# EAGLE schematic Totbox (EAGLE 9.6.2)
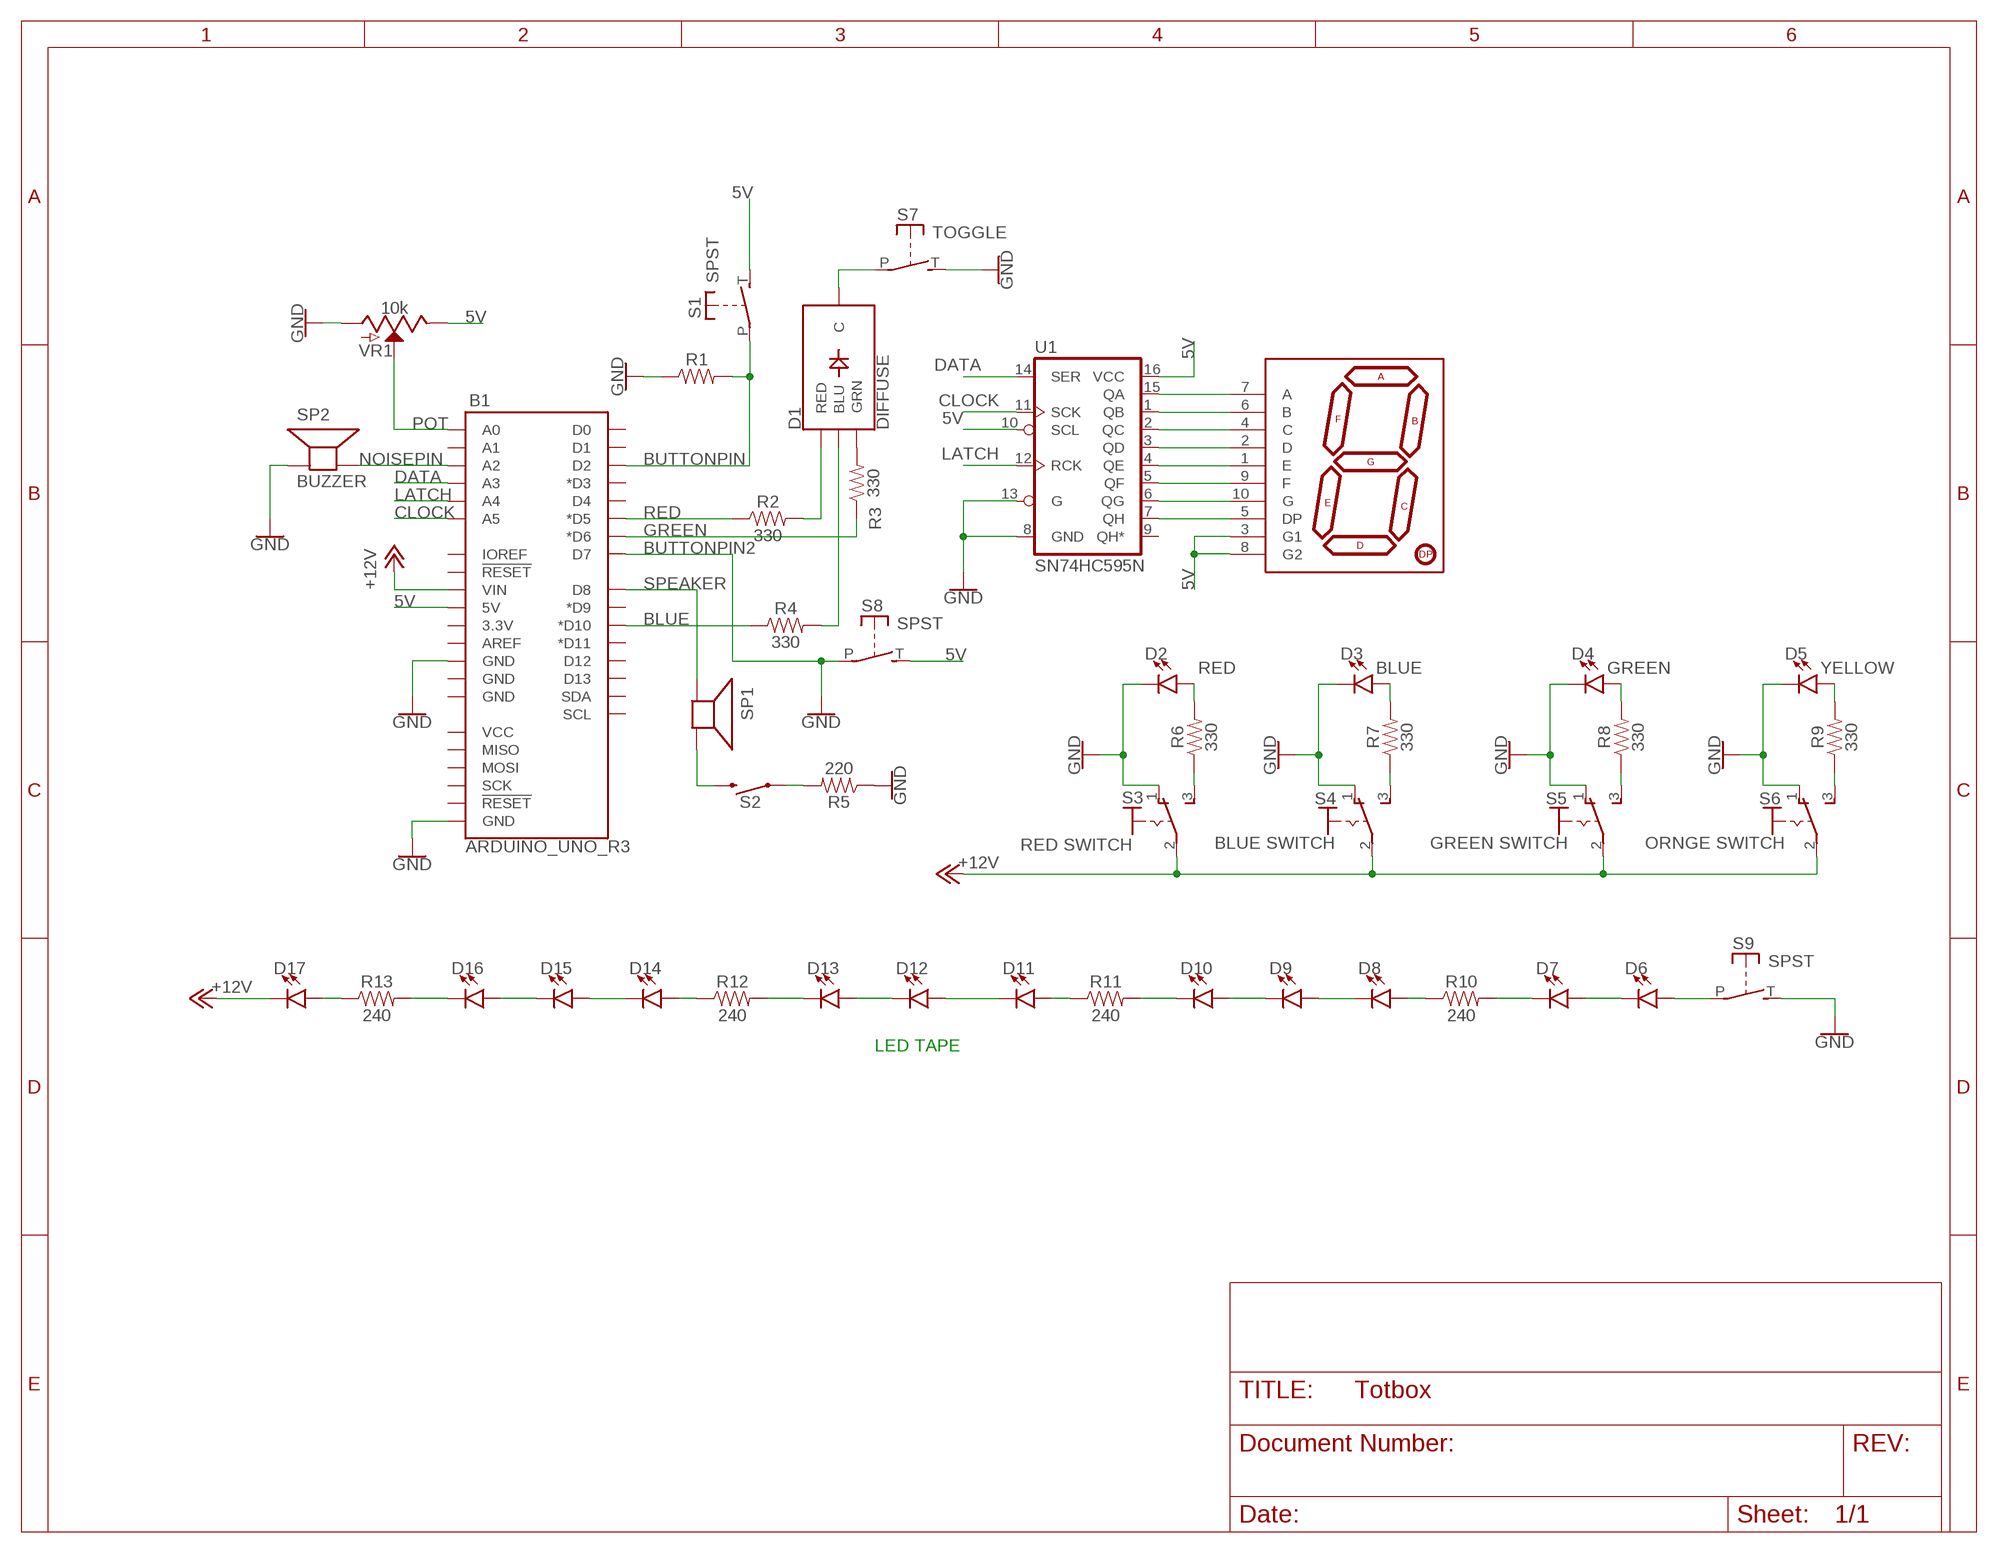
[diagram p0: schematic, sheet 1]

## Parts
B1  ARDUINO_UNO_R3  [ARDUINO_R3]
D1  DIFFUSE  LED-RGB-CCDIFFUSE  [LED-RGB-THRU]
D2  RED  LED5MM  [LED_5MM]
D3  BLUE  LED5MM  [LED_5MM]
D4  GREEN  LED5MM  [LED_5MM]
D5  YELLOW  LED5MM  [LED_5MM]
D6  LED-FKIT-1206  [FKIT-LED-1206]
D7  LED-FKIT-1206  [FKIT-LED-1206]
D8  LED-FKIT-1206  [FKIT-LED-1206]
D9  LED-FKIT-1206  [FKIT-LED-1206]
D10  LED-FKIT-1206  [FKIT-LED-1206]
D11  LED-FKIT-1206  [FKIT-LED-1206]
D12  LED-FKIT-1206  [FKIT-LED-1206]
D13  LED-FKIT-1206  [FKIT-LED-1206]
D14  LED-FKIT-1206  [FKIT-LED-1206]
D15  LED-FKIT-1206  [FKIT-LED-1206]
D16  LED-FKIT-1206  [FKIT-LED-1206]
D17  LED-FKIT-1206  [FKIT-LED-1206]
R1  RESISTORAXIAL-0.3  [AXIAL-0.3]
R2  330  RESISTORAXIAL-0.3  [AXIAL-0.3]
R3  330  RESISTORAXIAL-0.3  [AXIAL-0.3]
R4  330  RESISTORAXIAL-0.3  [AXIAL-0.3]
R5  220  RESISTORAXIAL-0.3  [AXIAL-0.3]
R6  330  RESISTORAXIAL-0.3  [AXIAL-0.3]
R7  330  RESISTORAXIAL-0.3  [AXIAL-0.3]
R8  330  RESISTORAXIAL-0.3  [AXIAL-0.3]
R9  330  RESISTORAXIAL-0.3  [AXIAL-0.3]
R10  240  240OHM-0603-1/10W-1%  [0603]
R11  240  240OHM-0603-1/10W-1%  [0603]
R12  240  240OHM-0603-1/10W-1%  [0603]
R13  240  240OHM-0603-1/10W-1%  [0603]
S1  SPST  [JUDCOSPST]
S2  MOMENTARY-SWITCH-SPST-PTH-6.0MM  [TACTILE_SWITCH_PTH_6.0MM]
S3  RED SWITCH  320-916  [320-916]
S4  BLUE SWITCH  320-916  [320-916]
S5  GREEN SWITCH  320-916  [320-916]
S6  ORNGE SWITCH  320-916  [320-916]
S7  TOGGLE  SPST  [JUDCOSPST]
S8  SPST  [JUDCOSPST]
S9  SPST  [JUDCOSPST]
SP1  SPEAKER/PS12  [PS12]
SP2  BUZZER  SPEAKER/PS12  [PS12]
U1  SN74HC595N  74HC595N  [DIP16]
U$1  YSD-1601AR4B-8  7-SEGMENT-1DIGIT-1INCH-RED  [7-SEGMENT-1"PTH]
VR1  10k  POTENTIOMETER-PTH-9MM-1/20W-20%  [POT-PTH-ALPS]

## Nets
5V: B1.5V S1.T(S) S8.T(S) U1.10(SCL) U1.16(VCC) U$1.3(G1) U$1.8(G2) VR1.P$1(E)
+12V: B1.VIN D17.C S3.2(P) S4.2(P) S5.2(P) S6.2(P)
BLUE: B1.D10(*D10) R4.P$1
BUTTONPIN: B1.D2 R1.P$2 S1.P
BUTTONPIN2: B1.D7 S8.P ; supply symbol labelled GND
CLOCK: B1.A5 U1.11(SCK)
DATA: B1.A3 U1.14(SER)
GND: B1.GND@1(GND) B1.GND@4(GND) D2.K(C) D3.K(C) D4.K(C) D5.K(C) R1.P$1 R5.P$1 S3.1(O) S4.1(O) S5.1(O) S6.1(O) S7.T(S) S9.T(S) SP2.P$1(+) U1.8(GND) U1.13(G) VR1.P$3(A)
GREEN: B1.D6(*D6) R3.P$1
LATCH: B1.A4 U1.12(RCK)
N$1: D1.3(GRN) R3.P$2
N$2: D1.4(BLU) R4.P$2
N$3: D1.1(RED) R2.P$2
N$4: D2.A R6.P$2
N$5: R5.P$2 S2.1
N$6: S2.3 SP1.P$2(-)
N$7: U1.1(QB) U$1.6(B)
N$8: U1.2(QC) U$1.4(C)
N$9: U1.3(QD) U$1.2(D)
N$10: U1.4(QE) U$1.1(E)
N$11: U1.5(QF) U$1.9(F)
N$12: U1.6(QG) U$1.10(G)
N$13: U1.7(QH) U$1.5(DP)
N$14: U1.15(QA) U$1.7(A)
N$15: R6.P$1 S3.3(S)
N$16: R7.P$1 S4.3(S)
N$17: D3.A R7.P$2
N$18: R8.P$1 S5.3(S)
N$19: D4.A R8.P$2
N$20: R9.P$1 S6.3(S)
N$21: D5.A R9.P$2
N$22: D1.2(C) S7.P
N$23: D6.C D7.A
N$24: D7.C R10.2
N$25: D8.A R10.1
N$26: D11.A R11.1
N$27: D9.C D10.A
N$28: D10.C R11.2
N$29: D14.A R12.1
N$30: D12.C D13.A
N$31: D13.C R12.2
N$32: D17.A R13.1
N$33: D15.C D16.A
N$34: D16.C R13.2
N$35: D11.C D12.A
N$36: D8.C D9.A
N$37: D14.C D15.A
N$38: D6.A S9.P
NOISEPIN: B1.A2 SP2.P$2(-)
POT: B1.A0 VR1.P$2(S)
RED: B1.D5(*D5) R2.P$1
SPEAKER: B1.D8 SP1.P$1(+)
Unconnected: B1.3.3V B1.A1 B1.AREF B1.D0 B1.D1 B1.D3(*D3) B1.D4 B1.D9(*D9) B1.D11(*D11) B1.D12 B1.D13 B1.GND@2(GND) B1.GND@3(GND) B1.IOREF B1.MISO B1.MOSI B1.RESET@1(!RESET!) B1.RESET@2(!RESET!) B1.SCK B1.SCL B1.SDA B1.VCC U1.9(QH*)

## Notes on the sheet
- LED TAPE

## Library data of the parts
B1 = SparkFun-Boards:ARDUINO_UNO_R3: Arduino R3 Footprint with SPI header Arduino Uno R3 Compatible Footprint. Matches PCB size of the original board. SparkFun Products: SAMD21 Dev Breakout <https://www.sparkfun.com/products/13672> RedBoard <https://www.sparkfun.com/products/12757> R3 Stackable Headers <https://www.sparkfun.com/products/11417>
D1 = SparkFun-LED:LED-RGB-CC: LED-RGB Common Cathode Packages: LED RGB-THRU LED_PIRANHA_5MM SparkFun Products: RGB Diffused Common Cathode- Diffuse <[https://www.sparkfun.com/products/9264]> RGB Diffused Common Cathode - Clear <[https://www.sparkfun.com/products/105]> LED-RGB 5mm Square (Piranha) <[https://www.sparkfun.com/products/11679]>; PROD_ID: DIO-09434
D2-D17 = SparkFun-LED:LED: LED (Generic) Standard schematic elements and footprints for 5mm, 3mm, 1206, and 0603 sized LEDs. Generic LEDs with no color specified.
R1-R9 = SparkFun-Resistors:RESISTOR: Generic Resistor Package
R10-R13 = SparkFun-Resistors:240OHM: 240Ω resistor A resistor is a passive two-terminal electrical component that implements electrical resistance as a circuit element. Resistors act to reduce current flow, and, at the same time, act to lower voltage levels within circuits. - Wikipedia; PROD_ID: RES-07849
S1 S7-S9 = adafruit:SPST: Judco 50-0015-00
S2 = SparkFun-Switches:MOMENTARY-SWITCH-SPST: Momentary Switch (Pushbutton) - SPST Normally-open (NO) SPST momentary switches (buttons, pushbuttons). Variants PTH-12MM - 12mm square, through-hole Momentary Pushbutton Switch - 12mm Square <https://www.sparkfun.com/products/9190> (COM-09190) PTH-6.0MM, PTH-6.0MM-KIT - 6.0mm square, through-hole Mini Pushbutton Switch <https://www.sparkfun.com/products/97> (COM-00097) KIT package intended for soldering kit's - only one side of pads' copper is exposed. PTH-RIGHT-ANGLE-KIT - Right-angle, through-hole Right Angle Tactile Button <https://www.sparkfun.com/products/10791> - Used on SparkFun BigTime Watch Kit <https://www.sparkfun.com/products/11734> SMD-12MM - 12mm square, surface-mount Tactile Button - SMD (12mm) <https://www.sparkfun.com/products/12993> (COM-12993) Used on SparkFun PicoBoard <https://www.sparkfun.com/products/11888> SMD-4.5MM - 4.5mm Square Trackball Switch Used on SparkFun Blackberry Trackballer Breakout <https://www.sparkfun.com/products/13169> SMD-4.6MMX2.8MM - 4.60mm x 2.80mm, surface mount Used on SparkFun SAMD21 Mini Breakout <https://www.sparkfun.com/products/13664> SMD-5.2MM, SMD-5.2-REDUNDANT - 5.2mm square, surface-mount Mini Pushbutton Switch - SMD <https://www.sparkfun.com/products/8720> (COM-08720) Used on Arduino Pro Mini <https://www.sparkfun.com/products/11114> REDUNDANT package connects both switch circuits together SMD-6.0X3.5MM - 6.0 x 3.5mm, surface mount Momentary Reset Switch SMD <https://www.sparkfun.com/products/8229> (COM-08229) SMD-6.2MM-TALL - 6.2mm square, surface mount Tactile Button - SMD (6mm) <https://www.sparkfun.com/products/12992> Used on SparkFun Digital Sandbox <https://www.sparkfun.com/products/12651> SMD-RIGHT-ANGLE - Right-angle, surface mount Used on SparkFun Block for Intel® Edison - Arduino <https://www.sparkfun.com/products/13036>; PROD_ID: SWCH-08441; SF_SKU: COM-00097
S3-S6 = switch:320-916: TOGGLE SWITCH distributor RS Components
SP1 SP2 = adafruit:SPEAKER: SPEAKER Source: Buerklin Added PS12 (for part # PS1240 piezo) http://www.ladyada.net/library/pcb/eaglelibrary.html
U1 = SparkFun-IC-Logic:74*595: 8-Bit Shift Register (Serial to Parallel) Datasheet <http://cdn.sparkfun.com/datasheets/BreakoutBoards/MM74HC595.pdf> SparkFun Products SparkFun Shift Register Breakout - 74HC595 <https://www.sparkfun.com/products/10680> (BOB-10680); PROD_ID: IC-13123
U$1 = SparkFun-LED:7-SEGMENT-1DIGIT-1INCH: 7-Segment Display, single digit, 1" EZ is for kits. Pads are only exposed on the bottom side to help prevent soldering in upside down. Datasheet (Red) <https://cdn.sparkfun.com/datasheets/Components/LED/YSD-160AR4B-8.pdf> Datasheet (Blue) <https://cdn.sparkfun.com/datasheets/Components/LED/YSD-160AB3C-8.pdf> SparkFun Products 7-Segment Display - LED (Red) <https://www.sparkfun.com/products/8546> (COM-08546) 7-Segment Display - LED (Blue) <https://www.sparkfun.com/products/9191> (COM-09191); PROD_ID: COMP-08615
VR1 = SparkFun-Resistors:POTENTIOMETER: Potentiometer (Pot) Three-terminal potentiometers, with an adjustable wiper and two adjustable resistors. A pot can be used to create a configurable voltage divider, or as a variable resistor. Variants ALPS_POT and ALPS_POT_KIT - PTH, breadboard compatible, 9mm square pots Rotary Potentiometer - Linear (10k ohm) <https://www.sparkfun.com/products/9288> (COM-09288) The KIT variant exposes copper on only one side of the PTH pad, so the part can only be assembled on one side of the PCB. Useful for beginner soldering kits.; PROD_ID: RES-09177; SF_SKU: COM-09288